# Altium schematic sheet Snippet of MS9333_Power.SchDoc
size A4
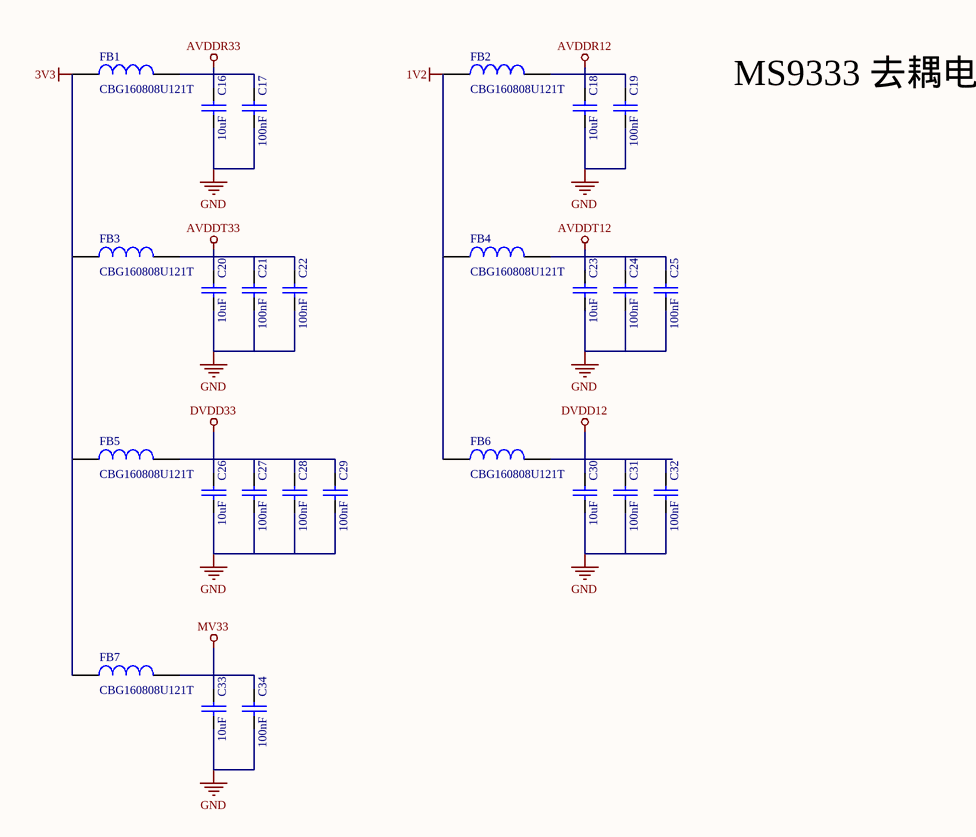
[diagram p0: Snippet of MS9333_Power.SchDoc]

## Parts
C16  10uF  [C_0603]
C17  100nF  [C_0402]
C18  10uF  [C_0603]
C19  100nF  [C_0402]
C20  10uF  [C_0603]
C21  100nF  [C_0402]
C22  100nF  [C_0402]
C23  10uF  [C_0603]
C24  100nF  [C_0402]
C25  100nF  [C_0402]
C26  10uF  [C_0603]
C27  100nF  [C_0402]
C28  100nF  [C_0402]
C29  100nF  [C_0402]
C30  10uF  [C_0603]
C31  100nF  [C_0402]
C32  100nF  [C_0402]
C33  10uF  [C_0603]
C34  100nF  [C_0402]
FB1  CBG160808U121T  [0603L]
FB2  CBG160808U121T  [0603L]
FB3  CBG160808U121T  [0603L]
FB4  CBG160808U121T  [0603L]
FB5  CBG160808U121T  [0603L]
FB6  CBG160808U121T  [0603L]
FB7  CBG160808U121T  [0603L]

## Nets
1V2: FB2.1 FB4.1 FB6.1
3V3: FB1.1 FB3.1 FB5.1 FB7.1
AVDDR12: C18.1 C19.1 FB2.2
AVDDR33: C16.1 C17.1 FB1.2
AVDDT12: C23.1 C24.1 C25.1 FB4.2
AVDDT33: C20.1 C21.1 C22.1 FB3.2
DVDD12: C30.1 C31.1 C32.1 FB6.2
DVDD33: C26.1 C27.1 C28.1 C29.1 FB5.2
GND: C16.2 C17.2 C18.2 C19.2 C20.2 C21.2 C22.2 C23.2 C24.2 C25.2 C26.2 C27.2 C28.2 C29.2 C30.2 C31.2 C32.2 C33.2 C34.2
MV33: C33.1 C34.1 FB7.2

## Notes on the sheet
- MS9333 去耦电容

## Library data of the parts
C16-C34 = Cap_Chip: 贴片电容; 厂家型号: *; 商品编号: *
FB1-FB7 = FB: 120R 100Mhz; Manufacturer_Name: FH(风华); Manufacturer_Part_Number: CBG160808U121T; LCSC: C50843